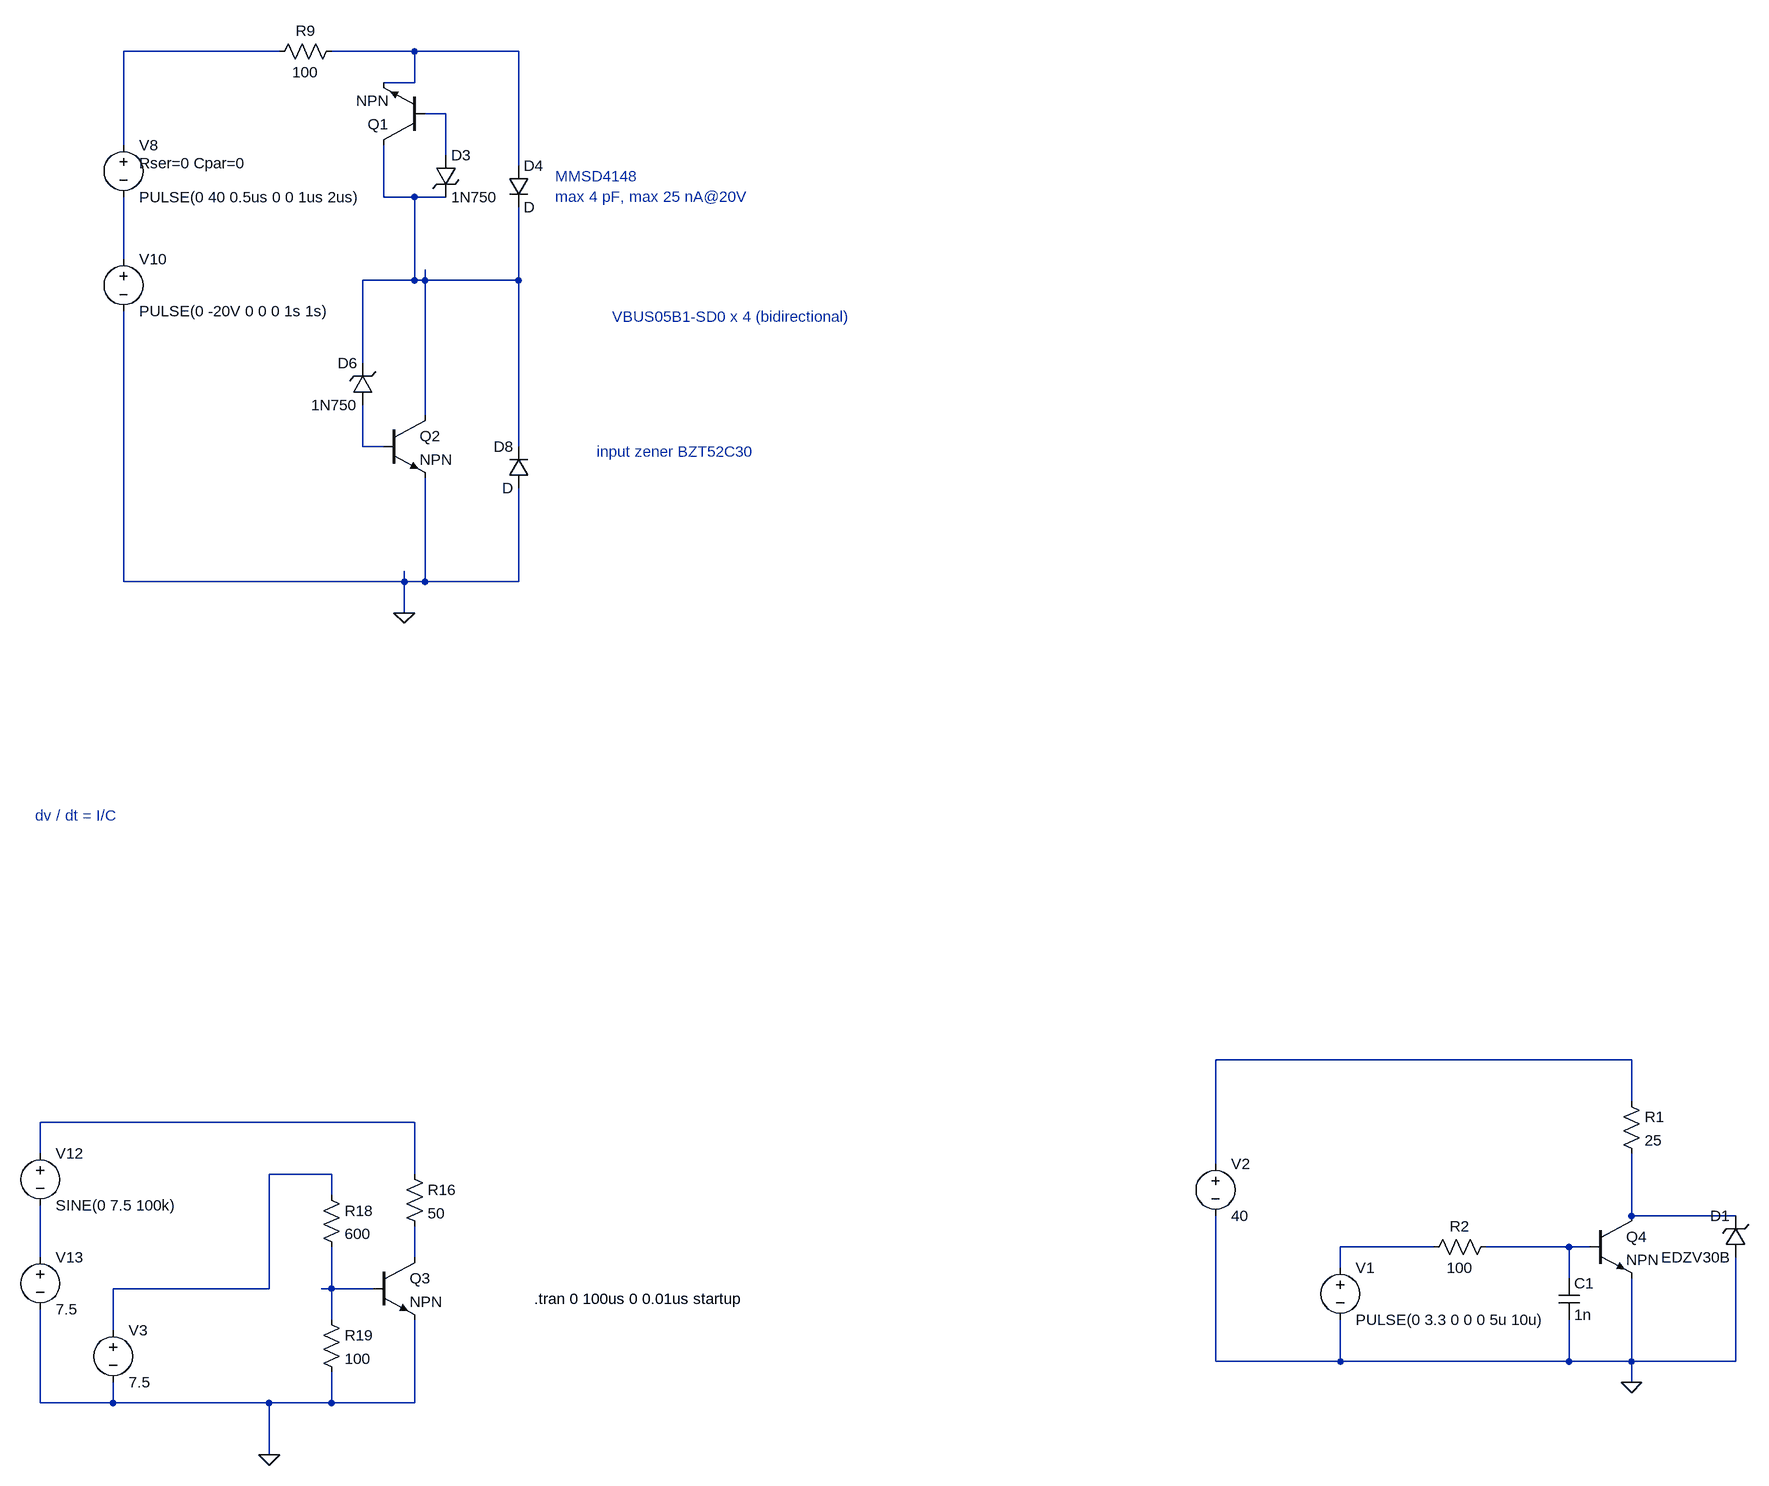
[diagram p0: schematic Switch output tests.asc]
Switch output tests.asc, the LTspice schematic file:
Version 4
SHEET 1 7608 4844
WIRE 0 -1648 -240 -1648
WIRE 208 -1648 80 -1648
WIRE 368 -1648 208 -1648
WIRE 208 -1600 208 -1648
WIRE 208 -1600 160 -1600
WIRE 256 -1552 224 -1552
WIRE -240 -1504 -240 -1648
WIRE 256 -1488 256 -1552
WIRE 368 -1472 368 -1648
WIRE 160 -1424 160 -1504
WIRE 208 -1424 160 -1424
WIRE 256 -1424 208 -1424
WIRE -240 -1328 -240 -1424
WIRE 208 -1296 208 -1424
WIRE 208 -1296 128 -1296
WIRE 224 -1296 224 -1312
WIRE 224 -1296 208 -1296
WIRE 368 -1296 368 -1408
WIRE 368 -1296 224 -1296
WIRE 128 -1168 128 -1296
WIRE 224 -1088 224 -1296
WIRE 128 -1040 128 -1104
WIRE 160 -1040 128 -1040
WIRE 368 -1040 368 -1296
WIRE -240 -832 -240 -1248
WIRE 192 -832 192 -848
WIRE 192 -832 -240 -832
WIRE 224 -832 224 -992
WIRE 224 -832 192 -832
WIRE 368 -832 368 -976
WIRE 368 -832 224 -832
WIRE 192 -784 192 -832
WIRE 2080 -96 1440 -96
WIRE 2080 -32 2080 -96
WIRE 208 0 -368 0
WIRE -368 48 -368 0
WIRE 1440 64 1440 -96
WIRE 80 80 -16 80
WIRE 208 80 208 0
WIRE 80 112 80 80
WIRE 2080 144 2080 48
WIRE 2240 144 2080 144
WIRE 1776 192 1632 192
WIRE 1984 192 1856 192
WIRE 2016 192 1984 192
WIRE -368 208 -368 128
WIRE 208 208 208 160
WIRE 1632 224 1632 192
WIRE 1984 240 1984 192
WIRE -16 256 -16 80
WIRE -16 256 -256 256
WIRE 80 256 80 192
WIRE 80 256 64 256
WIRE 144 256 80 256
WIRE 80 304 80 256
WIRE -256 320 -256 256
WIRE 1440 368 1440 144
WIRE 1632 368 1632 304
WIRE 1632 368 1440 368
WIRE 1984 368 1984 304
WIRE 1984 368 1632 368
WIRE 2080 368 2080 240
WIRE 2080 368 1984 368
WIRE 2240 368 2240 208
WIRE 2240 368 2080 368
WIRE 2080 400 2080 368
WIRE -368 432 -368 288
WIRE -256 432 -256 400
WIRE -256 432 -368 432
WIRE -16 432 -256 432
WIRE 80 432 80 384
WIRE 80 432 -16 432
WIRE 208 432 208 304
WIRE 208 432 80 432
WIRE -16 512 -16 432
FLAG 192 -784 0
FLAG -16 512 0
FLAG 2080 400 0
SYMBOL LTspiceXVII_2019Jan29\\LTspiceXVII\\lib\\sym\\voltage -240 -1520 R0
WINDOW 123 0 0 Left 0
WINDOW 39 24 44 Left 2
SYMATTR SpiceLine Rser=0 Cpar=0
SYMATTR InstName V8
SYMATTR Value PULSE(0 40 0.5us 0 0 1us 2us)
SYMBOL LTspiceXVII_2019Jan29\\LTspiceXVII\\lib\\sym\\npn 160 -1088 R0
SYMATTR InstName Q2
SYMBOL res 96 -1664 R90
WINDOW 0 0 56 VBottom 2
WINDOW 3 32 56 VTop 2
SYMATTR InstName R9
SYMATTR Value 100
SYMBOL diode 352 -1472 R0
SYMATTR InstName D4
SYMBOL diode 384 -976 R180
WINDOW 0 24 64 Left 2
WINDOW 3 24 0 Left 2
SYMATTR InstName D8
SYMBOL voltage -240 -1344 R0
WINDOW 123 0 0 Left 0
WINDOW 39 0 0 Left 0
SYMATTR InstName V10
SYMATTR Value PULSE(0 -20V 0 0 0 1s 1s)
SYMBOL zener 144 -1104 R180
WINDOW 0 24 64 Left 2
WINDOW 3 24 0 Left 2
SYMATTR InstName D6
SYMATTR Value 1N750
SYMATTR Description Diode
SYMATTR Type diode
SYMBOL LTspiceXVII_2019Jan29\\LTspiceXVII\\lib\\sym\\npn 224 -1504 R180
SYMATTR InstName Q1
SYMBOL zener 240 -1488 R0
SYMATTR InstName D3
SYMATTR Value 1N750
SYMATTR Description Diode
SYMATTR Type diode
SYMBOL LTspiceXVII_2019Jan29\\LTspiceXVII\\lib\\sym\\npn 144 208 R0
SYMATTR InstName Q3
SYMBOL voltage -256 304 R0
WINDOW 123 0 0 Left 0
WINDOW 39 0 0 Left 0
SYMATTR InstName V3
SYMATTR Value 7.5
SYMBOL res 192 64 R0
SYMATTR InstName R16
SYMATTR Value 50
SYMBOL voltage -368 32 R0
WINDOW 123 0 0 Left 0
WINDOW 39 0 0 Left 0
SYMATTR InstName V12
SYMATTR Value SINE(0 7.5 100k)
SYMBOL res 64 96 R0
SYMATTR InstName R18
SYMATTR Value 600
SYMBOL res 64 288 R0
SYMATTR InstName R19
SYMATTR Value 100
SYMBOL voltage -368 192 R0
WINDOW 123 0 0 Left 0
WINDOW 39 0 0 Left 0
SYMATTR InstName V13
SYMATTR Value 7.5
SYMBOL res 2064 -48 R0
SYMATTR InstName R1
SYMATTR Value 25
SYMBOL LTspiceXVII_2019Jan29\\LTspiceXVII\\lib\\sym\\npn 2016 144 R0
SYMATTR InstName Q4
SYMBOL res 1760 208 R270
WINDOW 0 32 56 VTop 2
WINDOW 3 0 56 VBottom 2
SYMATTR InstName R2
SYMATTR Value 100
SYMBOL cap 1968 240 R0
SYMATTR InstName C1
SYMATTR Value 1n
SYMBOL voltage 1632 208 R0
WINDOW 123 0 0 Left 0
WINDOW 39 0 0 Left 0
SYMATTR InstName V1
SYMATTR Value PULSE(0 3.3 0 0 0 5u 10u)
SYMBOL voltage 1440 48 R0
WINDOW 123 0 0 Left 0
WINDOW 39 0 0 Left 0
SYMATTR InstName V2
SYMATTR Value 40
SYMBOL zener 2256 208 R180
WINDOW 0 24 64 Left 2
WINDOW 3 24 0 Left 2
SYMATTR InstName D1
SYMATTR Value EDZV30B
SYMATTR Description Diode
SYMATTR Type diode
TEXT 392 272 Left 2 !.tran 0 100us 0 0.01us startup
TEXT -376 -472 Left 2 ;dv / dt = I/C
TEXT 424 -1456 Left 2 ;MMSD4148\nmax 4 pF, max 25 nA@20V
TEXT 512 -1240 Left 2 ;VBUS05B1-SD0 x 4 (bidirectional)
TEXT 488 -1032 Left 2 ;input zener BZT52C30

The netlist it stands for:
* Switch output tests.asc
V8 N001 N005 PULSE(0 40 0.5us 0 0 1us 2us) Rser=0 Cpar=0
Q2 N004 N006 0 0 NPN
R9 N002 N001 100
D4 N002 N004 D
D8 0 N004 D
V10 N005 0 PULSE(0 -20V 0 0 0 1s 1s)
D6 N006 N004 1N750
Q1 N004 N003 N002 0 NPN
D3 N003 N004 1N750
Q3 N014 N015 0 0 NPN
V3 N009 0 7.5
R16 N008 N014 50
V12 N008 N013 SINE(0 7.5 100k)
R18 N009 N015 600
R19 N015 0 100
V13 N013 0 7.5
R1 N007 N010 25
Q4 N010 N012 0 0 NPN
R2 N011 N012 100
C1 N012 0 1n
V1 N011 0 PULSE(0 3.3 0 0 0 5u 10u)
V2 N007 0 40
D1 0 N010 EDZV30B
.model D D
.lib standard.dio
.model NPN NPN
.model PNP PNP
.lib standard.bjt
.tran 0 100us 0 0.01us startup
* dv / dt = I/C
* MMSD4148
* max 4 pF, max 25 nA@20V
* VBUS05B1-SD0 x 4 (bidirectional)
* input zener BZT52C30
.backanno
.end